# Altium schematic sheet batsch-env.SchDoc
size A4; SheetNumber: 1; SheetTotal: 1
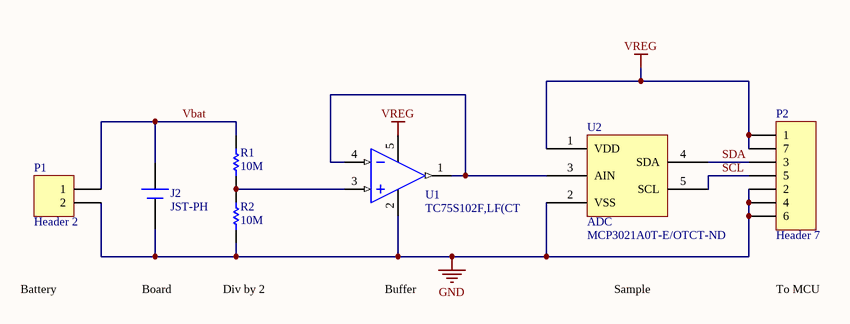
[diagram p0: batsch-env.SchDoc]

## Parts
J2  JST-PH  [JST-PH]
P1  Header 2  [HDR1X2]
P2  Header 7  [HDR1X7]
R1  value 10M  [1206]  (hidden comment: Res1)
R2  value 10M  [1206]  (hidden comment: Res1)
U1  TC75S102F,LF(CT  [OPAMP TOSHIBA]
U2  ADC  Supplier Part Number 1: MCP3021A0T-E/OTCT-ND  [I2C SOT23]

## Nets
GND: J2.2(-) P1.2 P2.2 P2.4 P2.6 R2.2 U1.2(Vss) U2.2(VSS)
VREG: P2.1 P2.7 U1.5(V+) U2.1(VDD)
SCL: P2.5 U2.5(SCL)
SDA: P2.3 U2.4(SDA)
Vbat: J2.1(+) P1.1 R1.1
NetR1_2: R1.2 R2.1 U1.3(IN+)
NetU1_1: U1.1(OUT) U1.4(IN-) U2.3(AIN)

## Notes on the sheet
- Battery
- Board
- Div by 2
- Buffer
- Sample
- To MCU

## Library data of the parts
J2 = JST-PH: Input/Output
P1 = Header 2: Header, 2-Pin; LatestRevisionDate: 17-Jul-2002; LatestRevisionNote: Re-released for DXP Platform.; Publisher: Altium Limited
P2 = Header 7: Header, 7-Pin; LatestRevisionDate: 17-Jul-2002; LatestRevisionNote: Re-released for DXP Platform.; Publisher: Altium Limited
R1 R2 = resistor 10M: Resistor; Tolerance: 10%; Published: 8-Jun-2000; LatestRevisionDate: 17-Jul-2002; LatestRevisionNote: Re-released for DXP Platform.; PackageReference: AXIAL-0.3; Publisher: Altium Limited; PackageDescription: Axial Device, Thru-Hole; 2 Leads; 0.3 in Pin Spacing
U1 = TC75S102F,LF(CT: Op Amp Single Ultra Low Current Amplifier 5.5V 5-Pin SMV T/R; Manufacturer: Toshiba; Supplier 1: Digi-Key; Manufacturer Part Number: TC75S102F,LF(CT; RoHS: No; Category: Amplifiers - Op Amps, Buffer, Instrumentation; Stock 1: 4549; Pricing 1: 1=0.47000, 10=0.39800, 25=0.37160, 100=0.29740, 250=0.27616, 500=0.23366, 1000=0.18056 (USD); Supplier Part Number 1: 264-TC75S102FLF(CT-ND
U2 = MCP3021A0T-E/OT: 1-Channel Single ADC SAR 22.3ksps 10-bit Serial Automotive 5-Pin SOT-23 T/R; Manufacturer: Microchip; Sampling Rate: 22.3KS/s; Interface: I2C,Serial; Number of Bits: 10; Resolution: 10b; Number of Analog Inputs: 1; Polarity: Unipolar; Operating Supply Voltage: 5V; Min Supply Voltage: 2.7V; Max Supply Voltage: 5.5V; Integral Nonlinearity (INL): 1LSB; Signal to Noise Ratio (SNR): 60dB; Input Type: SINGLE-ENDED; Supplier 1: Digi-Key; Manufacturer Part Number: MCP3021A0T-E/OT; RoHS: Yes; Category: Analog to Digital Converters (ADCs); Stock 1: 1856; Pricing 1: 1=1.29000, 25=1.07080, 100=0.99000 (USD); Mount: Surface Mount; Case/Package: SOT-23; Number of Pins: 5; Min Operating Temperature: -40°C; Max Operating Temperature: 125°C; Packaging: Tape and Reel; Number of A/D Converters: 1; Number of Channels: 1; Number of Converters: 1; Number of Elements: 1; Conversion Rate: 22.3KS/s; Radiation Hardening: No; Lead Free: Lead Free; RoHS Compliant: Yes; ComponentLink1URL: https://datasheet.ciiva.com/1255/21805a-1255936.pdf?src-supplier=Digi-Key; ComponentLink1Description: https://datasheet.ciiva.com/1255/21805a-1255936.pdf?src-supplier=Digi-Key; ComponentLink2URL: https://datasheet.ciiva.com/26937/getdatasheetpartid-766115-26937716.pdf?src-supplier=Verical; ComponentLink2Description: https://datasheet.ciiva.com/26937/getdatasheetpartid-766115-26937716.pdf?src-supplier=Verical; ComponentLink3URL: https://datasheet.ciiva.com/1255/21805a-1255934.pdf?src-supplier=Digi-Key; ComponentLink3Description: https://datasheet.ciiva.com/1255/21805a-1255934.pdf?src-supplier=Digi-Key; ComponentLink4URL: https://datasheet.ciiva.com/1255/21805a-1255935.pdf?src-supplier=Digi-Key; ComponentLink4Description: https://datasheet.ciiva.com/1255/21805a-1255935.pdf?src-supplier=Digi-Key; ComponentLink5URL: https://datasheet.ciiva.com/16625/21805a-16625790.pdf?src-supplier=Avnet+Europe; ComponentLink5Description: https://datasheet.ciiva.com/16625/21805a-16625790.pdf?src-supplier=Avnet+Europe; ComponentLink6URL: https://datasheet.ciiva.com/16454/filehandler-aspxddocname-en011709-16454205.pdf?src-supplier=Future+Electronics; ComponentLink6Description: https://datasheet.ciiva.com/16454/filehandler-aspxddocname-en011709-16454205.pdf?src-supplier=Future+Electronics